# EAGLE design PROK drum_F (EAGLE 7.6.0)
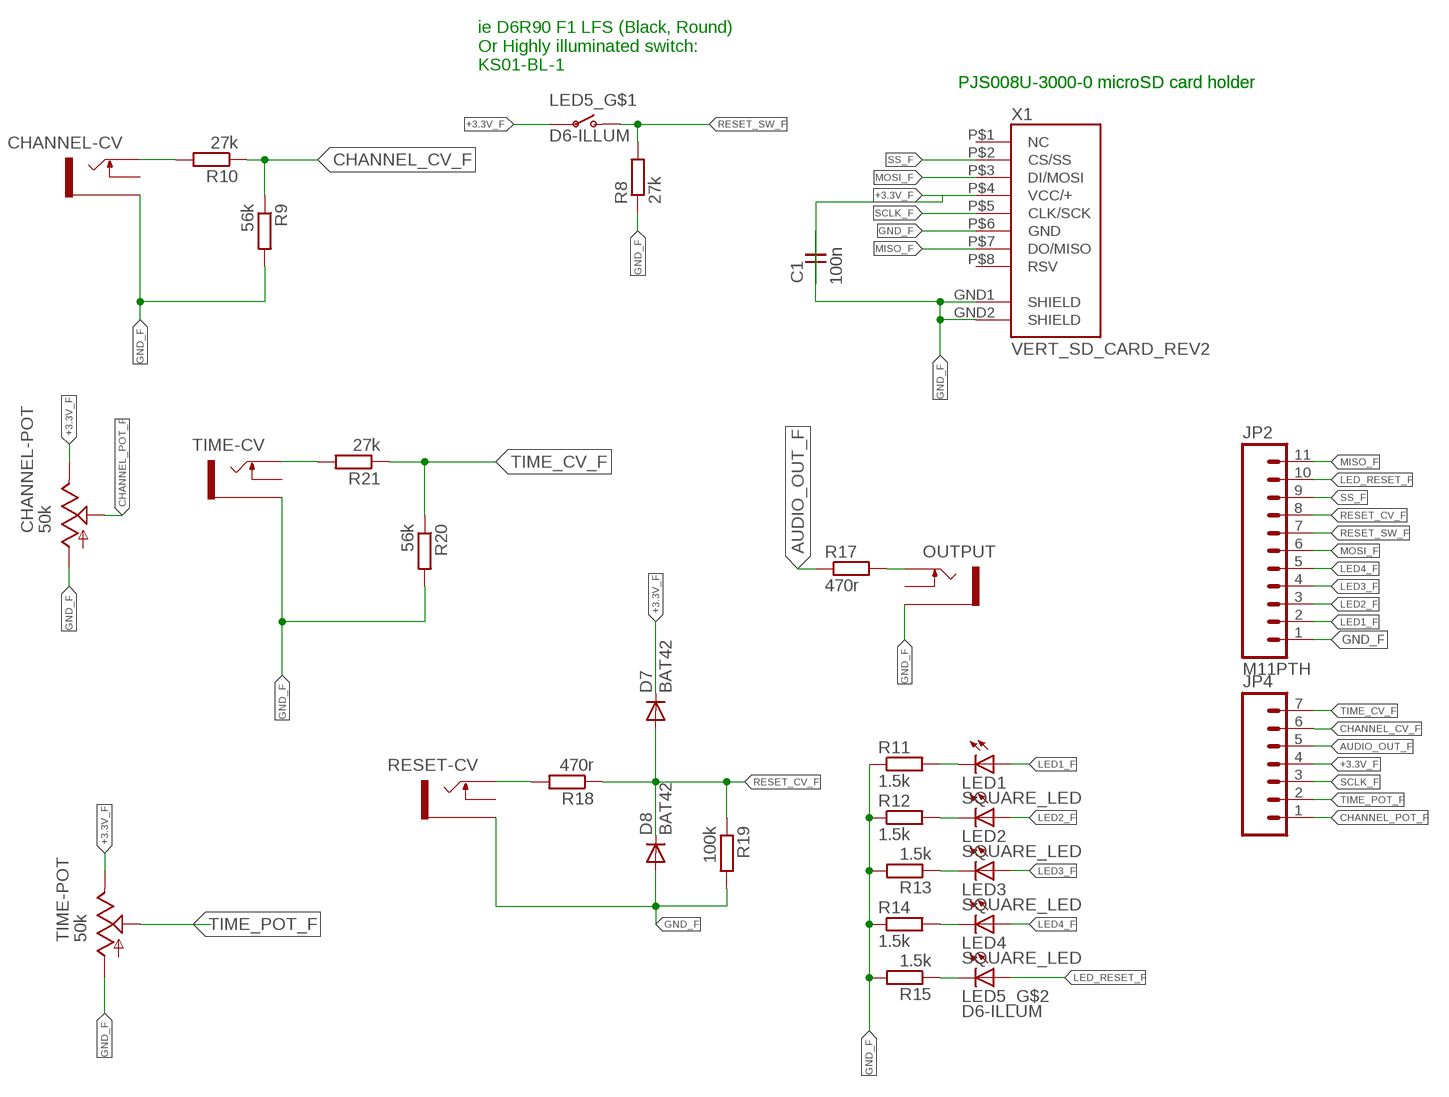
[diagram p0: schematic, sheet 1]

## Parts
C1  100n  C-EU050-024X044  [C050-024X044]
CHANNEL-CV  THONKICONNNEW  [WQP-PJ301M-12_JACK]
CHANNEL-POT  50k  ALPHA-9MMF2A  [EVUF]
D7  BAT42  [DO34-7]
D8  BAT42  [DO34-7]
JP2  M11PTH  [1X11]
JP4  M07  [1X07]
LED1  SQUARE_LED  [SQUARE_LED]
LED2  SQUARE_LED  [SQUARE_LED]
LED3  SQUARE_LED  [SQUARE_LED]
LED4  SQUARE_LED  [SQUARE_LED]
LED5_  D6-ILLUM  [D6_PUSH_SWITCH_ILLUM]
OUTPUT  THONKICONNNEW  [WQP-PJ301M-12_JACK]
R8  27k  RESISTOR7MM  [7MM_RESISTOR]
R9  56k  RESISTOR7MM  [7MM_RESISTOR]
R10  27k  RESISTORVERTICAL  [VERTICAL_RESISTOR]
R11  1.5k  RESISTOR7MM  [7MM_RESISTOR]
R12  1.5k  RESISTOR7MM  [7MM_RESISTOR]
R13  1.5k  RESISTORVERTICAL  [VERTICAL_RESISTOR]
R14  1.5k  RESISTOR7MM  [7MM_RESISTOR]
R15  1.5k  RESISTOR7MM  [7MM_RESISTOR]
R17  470r  RESISTOR7MM  [7MM_RESISTOR]
R18  470r  RESISTOR7MM  [7MM_RESISTOR]
R19  100k  RESISTOR7MM  [7MM_RESISTOR]
R20  56k  RESISTORVERTICAL  [VERTICAL_RESISTOR]
R21  27k  RESISTORVERTICAL  [VERTICAL_RESISTOR]
RESET-CV  THONKICONNNEW  [WQP-PJ301M-12_JACK]
TIME-CV  THONKICONNNEW  [WQP-PJ301M-12_JACK]
TIME-POT  50k  ALPHA-9MMF2A  [EVUF]
X1  VERT_SD_CARD_REV2  [VERT_MICROSD_REV2]

## Nets
+3.3V_F: C1.2 CHANNEL-POT.3(E) D7.C JP4.4 LED5_.P$3(P) LED5_.P$4(P) TIME-POT.3(E) X1.P$4(VCC/+)
AUDIO_OUT_F: JP4.5 R17.1
CHANNEL_CV_F: JP4.6 R9.1 R10.1
CHANNEL_POT_F: CHANNEL-POT.2(S) JP4.1
GND_F [ground]: C1.1 CHANNEL-CV.P$3_SLEEVE(SLEEVE) CHANNEL-POT.1(A) D8.A JP2.1 OUTPUT.P$3_SLEEVE(SLEEVE) R8.1 R9.2 R11.1 R12.1 R13.2 R14.1 R15.2 R19.2 R20.2 RESET-CV.P$3_SLEEVE(SLEEVE) TIME-CV.P$3_SLEEVE(SLEEVE) TIME-POT.1(A) X1.GND1(SHIELD) X1.GND2(SHIELD) X1.P$6(GND)
LED1_F: JP2.2 LED1.ANODE(A)
LED2_F: JP2.3 LED2.ANODE(A)
LED3_F: JP2.4 LED3.ANODE(A)
LED4_F: JP2.5 LED4.ANODE(A)
LED_RESET_F: JP2.10 LED5_.LED+(A)
MISO_F: JP2.11 X1.P$7(DO/MISO)
MOSI_F: JP2.6 X1.P$3(DI/MOSI)
N$1: CHANNEL-CV.P$1_TIP(TIP) R10.2
N$2: R21.2 TIME-CV.P$1_TIP(TIP)
N$3: OUTPUT.P$1_TIP(TIP) R17.2
N$14: R18.2 RESET-CV.P$1_TIP(TIP)
N$18: LED1.CATHODE(C) R11.2
N$19: LED2.CATHODE(C) R12.2
N$20: LED3.CATHODE(C) R13.1
N$21: LED4.CATHODE(C) R14.2
N$25: LED5_.LED-(C) R15.1
RESET_CV_F: D7.A D8.C JP2.8 R18.1 R19.1
RESET_SW_F: JP2.7 LED5_.P$1(O) LED5_.P$2(O) R8.2
SCLK_F: JP4.3 X1.P$5(CLK/SCK)
SS_F: JP2.9 X1.P$2(CS/SS)
TIME_CV_F: JP4.7 R20.1 R21.1
TIME_POT_F: JP4.2 TIME-POT.2(S)
Unconnected: CHANNEL-CV.P$2_SWITCH(SWITCH) OUTPUT.P$2_SWITCH(SWITCH) RESET-CV.P$2_SWITCH(SWITCH) TIME-CV.P$2_SWITCH(SWITCH) X1.P$1(NC) X1.P$8(RSV)

## Notes on the sheet
- ie D6R90 F1 LFS (Black, Round)
  Or Highly illuminated switch: 
  KS01-BL-1
- PJS008U-3000-0 microSD card holder | PJS008U-3000-0 microSD card holder

## Library data of the parts
C1 = TomW:C-EU: CAPACITOR, European symbol
CHANNEL-CV OUTPUT RESET-CV TIME-CV = MusicThingModular:THONKICONN: 3.5mm socket for Eurorack modular synths
CHANNEL-POT TIME-POT = TomW:ALPHA-9MM: 9 mm Square Rotary Potentiometers Source: Panasonic
D7 D8 = radiomusic:BAT42
JP2 = SparkFun-Connectors:M11: Header 11 Standard 11-pin 0.1" header. Use with straight break away headers (SKU : PRT-00116), right angle break away headers (PRT-00553), swiss pins (PRT-00743), machine pins (PRT-00117), and female headers (PRT-00115).
JP4 = SparkFun-Connectors:M07: Header 7 Standard 7-pin 0.1" header. Use with straight break away headers (SKU : PRT-00116), right angle break away headers (PRT-00553), swiss pins (PRT-00743), machine pins (PRT-00117), and female headers (PRT-00115). NOTES ON THE VARIANTS LOCK and LOCK_LONGPADS... This footprint was designed to help hold the alignment of a through-hole component (i.e. 7-pin header) while soldering it into place. You may notice that each hole has been shifted either up or down by 0.005 of an inch from it's more standard position (which is usually a perfectly straight line). This slight alteration caused the pins (the squares in the middle) to touch the edges of the holes. Because they are alternating, it causes a "brace" to hold the header in place. 0.005 has proven to be the perfect amount of "off-center" position when using our standard breakaway headers. Although looks a little odd when you look at the bare footprint, once you have a header in there, the alteration is very hard to notice. Also, if you push a header all the way into place, it is covered up entirely on the bottom side. This idea of altering the position of holes to aid alignment will be further integrated into the Sparkfun Library for other footprints. It can help hold any component with 3 or more connection pins.
LED1-LED4 = radiomusic:SQUARE_LED
LED5_ = MusicThingModular:D6-ILLUM
R8-R15 R17-R21 = MusicThingModular:RESISTOR: Standard resistor, various versions
X1 = TomW:VERT_SD_CARD_REV2

## Net classes
0 default: width 0.254 mm
1 power: width 0.457 mm
2 ground: width 0.457 mm

## Board
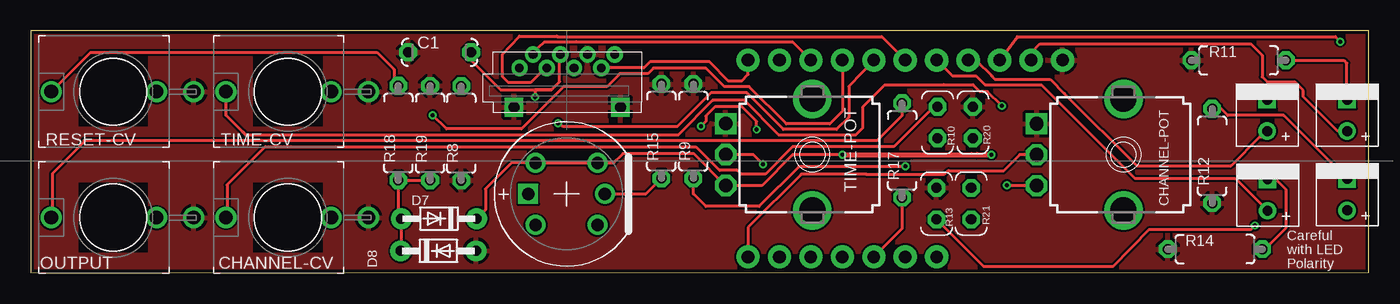
[diagram p1: board, top side]
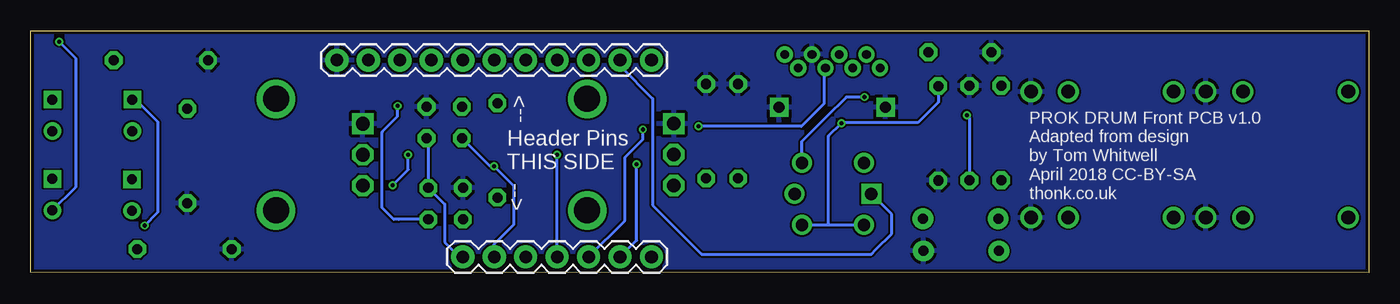
[diagram p2: board, bottom side, seen from below]

Size 107.99 x 19.5 mm. Coordinates in mm from the lower left corner, seen from the top.
Outline: 0,19.5 0,0 107.99,0.01 107.99,19.5 0,19.5
Copper layers (1*2*15*16): Top 0.035mm / dielectric 0.2mm / Route2 0.0175mm / dielectric 1.1mm / Route15 0.0175mm / dielectric 0.2mm / Bottom 0.035mm
Design rules "SeeedStudio_DRU_no_angle_20130527 *": minimum track width 6mil, minimum drill 12mil, track to track 6mil, track to pad 6mil, pad to pad 6mil, via to via 6mil, smd to smd 0mil, copper to edge 10mil, drill to drill 10mil, minimum pad ring 12mil, minimum via ring 6mil, stop-mask expansion 2mil, vias tented up to drill 25mil, thermal gap 10mil

### Footprints (pad centres in the part's own frame; a part is rotated, then mirrored left to right if it is on the bottom)
C050-024X044 = drill 0.813 octagon: 1 -2.54,0; 2 2.54,0
WQP-PJ301M-12_JACK = drill 1.1: P$1_TIP 0,5; P$2_SWITCH 0,-3.5; P$3_SLEEVE 0,-6.5
EVUF = drill 1.1 square: 1 -2.5,-7 | drill 1.1 octagon: 2 0,-7; 3 2.5,-7 | drill 2.1: M1 4.5,0; M2 -4.5,0
DO34-7 = drill 0.8 pad 1.676: A 3.04,0 | drill 0.813 pad 1.676: C -3.04,0
1X11 = drill 1.016 pad 1.88: 1 0,0; 2 2.54,0; 3 5.08,0; 4 7.62,0; 5 10.16,0; 6 12.7,0; 7 15.24,0; 8 17.78,0; 9 20.32,0; 10 22.86,0; 11 25.4,0
1X07 = drill 1.016 pad 1.88: 1 0,0; 2 2.54,0; 3 5.08,0; 4 7.62,0; 5 10.16,0; 6 12.7,0; 7 15.24,0
SQUARE_LED = drill 0.8: ANODE 1.27,0 | drill 0.8 square: CATHODE -1.27,0
D6_PUSH_SWITCH_ILLUM = drill 1 square: LED+ 3.1,0 | drill 1: LED- -3.1,0; P$1 -2.5,2.5; P$2 2.5,2.5; P$3 2.5,-2.5; P$4 -2.5,-2.5
7MM_RESISTOR = drill 0.813 octagon: 1 -3.81,0; 2 3.81,0
VERTICAL_RESISTOR = drill 0.813 octagon: 1 -1.27,0; 2 1.27,0
VERT_MICROSD_REV2 = drill 0.9 square: GND1 -4.3,-3.17; GND2 4.3,-3.17 | drill 0.7: P$1 -3.85,0; P$2 -2.75,1.1; P$3 -1.65,0; P$4 -0.55,1.1; P$5 0.55,0; P$6 1.65,1.1; P$7 2.75,0; P$8 3.85,1.1

### Placement (x,y rotation side)
C1  32.99,17.78 0 top
CHANNEL-CV  20.74,4.45 90 top
CHANNEL-POT  88.2,9.52 270 top
D7  32.94,4.35 180 top
D8  32.89,1.75 0 top
JP2  83.29,17.14 0 bottom
JP4  57.89,1.27 180 bottom
LED1  106.26,12.69 270 top
LED2  106.26,6.29 270 top
LED3  99.81,12.69 270 top
LED4  99.84,6.26 270 top
LED5_  43.24,6.35 180 top
OUTPUT  6.64,4.44 90 top
R8  34.73,11.24 90 top
R9  53.48,11.41 90 top
R10  73.19,12.12 90 top
R11  97.5,17.14 0 top
R12  95.36,9.41 90 top
R13  73.11,5.57 90 top
R14  95.59,1.9 0 top
R15  50.9,11.41 90 top
R17  70.33,9.86 90 top
R18  29.66,11.27 90 top
R19  32.23,11.26 90 top
R20  76.05,12.12 90 top
R21  75.91,5.57 270 top
RESET-CV  6.64,14.61 90 top
TIME-CV  20.74,14.61 90 top
TIME-POT  63.09,9.53 270 top
X1  43.29,16.51 0 top

### Tracks (layer width: path | path; a pad name or v marks a point on that pad's centre or on a via)
+3.3V_F  (via drill 0.33, 0.33 pad 0.64)
  Top 0.254: C1.2 35.53,17.13 37.9,14.76 42.02,14.75 | 42.02,14.75 42.69,15.42 42.69,17.56 X1.P$4 | v65.51,9.53 65.48,9.5 61.49,9.5 59.02,7.03 TIME-POT.3 53.52,9.6 47.79,9.6 47.04,8.85 LED5_.P$4 LED5_.P$3 38.79,8.85 36.69,6.75 36.69,5.06 D7.C | v40.69,14.17 40.69,14.75 42.01,14.76 42.02,14.75 | CHANNEL-POT.3 78.82,7.01 v78.79,7.05
  Top 0.4: 75.94,9.53 77.52,9.53 v77.54,9.5
  Top 0.406: v65.51,9.53 75.94,9.53 76.39,9.53
  Bottom 0.254: LED5_.P$4 45.74,10.61 43.8,12.55 43.79,12.55 42.17,14.17 v40.69,14.17 | JP4.4 v65.51,9.53 | v78.79,7.05 77.54,8.3 v77.54,9.5
AUDIO_OUT_F
  Top 0.254: JP4.5 69.08,2.31 69.32,2.54 70.33,3.55 R17.1
CHANNEL_CV_F  (via drill 0.33)
  Top 0.254: v70.59,8.57 66.46,8.57 66.44,8.55 61.99,8.55 58.79,5.35 54.49,5.35 53.48,6.36 R9.1
  Bottom 0.254: JP4.6 70.59,2.3 68.99,3.9 68.99,6.97 v70.59,8.57 70.92,8.57 R10.1
CHANNEL_POT_F
  Top 0.254: 57.79,1.25 57.87,1.25 JP4.1 57.89,3.65 62.19,7.95 65.49,7.95 67.41,7.94 73.77,7.94 74.08,8.26 74.15,8.19 78.51,8.19 79.83,9.52 CHANNEL-POT.2
GND_F
  pour Bottom: -4.02,25.46 116.49,25.23 114.12,-5.03 -4.52,-3.78 -4.21,22.23
  pour Top: -3.37,23.25 114.19,22.68 114.22,-4.36 -3.08,-4.07 -3.16,22.12
LED1_F
  Top 0.254: LED1.ANODE 105.51,11.42 102.72,14.21 102.72,14.71 102.08,15.35 99.85,15.35 99.41,15.79 99.41,17.54 98.49,18.46 81.46,18.46 80.75,17.75 JP2.2
LED2_F  (via drill 0.33 pad 0.64)
  Top 0.254: JP2.3 79.62,19.04 105.31,19.04 v105.71,18.64
  Bottom 0.254: v105.71,18.64 104.38,17.31 104.38,6.9 LED2.ANODE
LED3_F
  Top 0.254: JP2.4 76.3,17.14 77.57,15.88 77.57,15.86 77.84,15.6 82.29,15.6 83.45,14.44 89.3,8.64 96.91,8.64 99.22,10.95 99.34,10.95 LED3.ANODE
LED4_F
  Top 0.254: JP2.5 74.4,15.88 76.3,15.88 77.03,15.15 81.59,15.15 89.13,7.61 97.22,7.61 LED4.ANODE
LED_RESET_F
  Bottom 0.254: JP2.10 60.43,16.69 57.79,14.05 57.79,5.45 53.84,1.5 40.14,1.5 39.77,1.87 38.49,3.15 38.49,4.7 LED5_.LED+
MISO_F
  Top 0.254: JP2.11 57.89,16 57.39,15.5 56.29,15.5 54.79,17 49.96,17 49.49,16.53 46.06,16.53 X1.P$7
MOSI_F
  Top 0.254: JP2.6 68.68,19.05 42.52,19.05 42.45,19.08 39.44,19.08 38.09,17.63 38.09,15.79 38.55,15.33 40.33,15.33 41.51,16.51 X1.P$3
N$1
  Top 0.254: 18.92,10.16 18.91,10.15 | 18.91,10.15 15.83,7.07 15.83,4.53 CHANNEL-CV.P$1_TIP | R10.2 72.89,13.38 69.67,10.16 61.5,10.16 59.29,7.95 57.34,7.95 57.04,8.25 55.59,8.25 54.04,9.8 53.69,10.15 18.91,10.15
N$2  (via drill 0.33 pad 0.64)
  Top 0.254: TIME-CV.P$1_TIP 15.75,12.68 17.08,11.36 17.33,11.1 52.24,11.1 55.04,13.9 57.59,13.9 60.39,11.1 66.57,11.1 67.16,11.68 67.16,13.37 68.94,15.15 73.67,15.15 73.7,15.18 76.05,15.18 76.62,14.61 77.23,14.61 v78.39,13.45
  Bottom 0.254: v78.39,13.45 78.39,12.6 79.63,11.36 79.63,5.23 78.7,4.3 78.28,4.3 | R21.2 78.28,4.3 | R21.2 78.27,4.29 78.28,4.3
N$3
  Top 0.254: R17.2 70.33,12.66 68.34,10.67 4.27,10.67 4.27,10.53 1.72,7.98 1.72,4.52 OUTPUT.P$1_TIP
N$14
  Top 0.254: R18.2 29.31,15.42 29.31,16.4 27.93,17.78 4.81,17.78 RESET-CV.P$1_TIP
N$18
  Top 0.254: R11.2 106.02,17.14 106.23,16.91 106.23,13.98 LED1.CATHODE
N$19
  Top 0.254: LED2.CATHODE 101.13,12.69 96.62,12.69 96.08,13.22 R12.2
N$20  (via drill 0.33 pad 0.64)
  Top 0.254: R13.1 76.91,0.5 87.34,0.5 87.35,0.49 90.3,3.49 98.51,3.49 v98.82,3.8
  Bottom 0.254: v98.82,3.8 97.77,4.85 97.77,12.19 99.54,13.96 LED3.CATHODE
N$21
  Top 0.254: R14.2 99.61,1.9 101.34,3.62 101.34,6.7 100.51,7.53 LED4.CATHODE
N$25
  Top 0.254: LED5_.LED- 49.65,6.35 R15.1
RESET_CV_F  (via drill 0.33 pad 0.64)
  Top 0.254: R19.1 R18.1 29.66,4.59 D7.A 29.9,1.8 D8.C | JP2.8 65.51,13.02 64.49,12 60.99,12 57.99,15 55.99,15 54.49,16.5 50.26,16.5 49.81,16.05 47.54,16.05 46.49,15 42.99,15 39.59,11.6 33.54,11.6 v32.44,12.7
  Bottom 0.254: v32.44,12.7 32.23,12.48 R19.1
RESET_SW_F  (via drill 0.33)
  Top 0.254: JP2.7 66.04,15.04 66.04,12.55 65.04,11.55 60.74,11.55 57.79,14.5 54.89,14.5 52.19,11.8 42.93,11.8 v42.56,12.06
  Bottom 0.254: R8.2 34.73,13.76 36.39,12.1 42.52,12.1 v42.56,12.06 43.59,11.04 43.59,3.9 43.64,3.85 LED5_.P$1 LED5_.P$2
SCLK_F  (via drill 0.33 pad 0.64)
  Top 0.254: v58.59,11.55 58.59,12.2 57.39,13.4 55.24,13.4 54.49,12.65 54.49,12.2 v54.09,11.8
  Bottom 0.254: JP4.3 60.04,4.2 60.04,9.3 58.59,10.75 v58.59,11.55 | X1.P$5 43.94,16.41 43.94,13.65 45.79,11.8 v54.09,11.8
SS_F
  Top 0.254: JP2.9 61.5,18.62 43.99,18.62 44.05,18.63 41.45,18.63 40.54,17.77 X1.P$2
TIME_CV_F
  Bottom 0.254: JP4.7 73.41,1.27 74.59,2.45 74.59,5.52 R21.1 75.91,10.7 R20.1
TIME_POT_F  (via drill 0.33 pad 0.64)
  Top 0.254: v59.09,8.75 58.32,9.53 TIME-POT.2
  Bottom 0.254: JP4.2 59.09,2.61 v59.09,8.75

### Text on the board
tPlace: Careful / with LED / Polarity
bPlace: --> | Header Pins / THIS SIDE | --> | PROK DRUM Front PCB v1.0 / Adapted from design / by Tom Whitwell / April 2018 CC-BY-SA / thonk.co.uk